# Altium schematic sheet Sheet_1.schdoc
size 322 x 221 mm
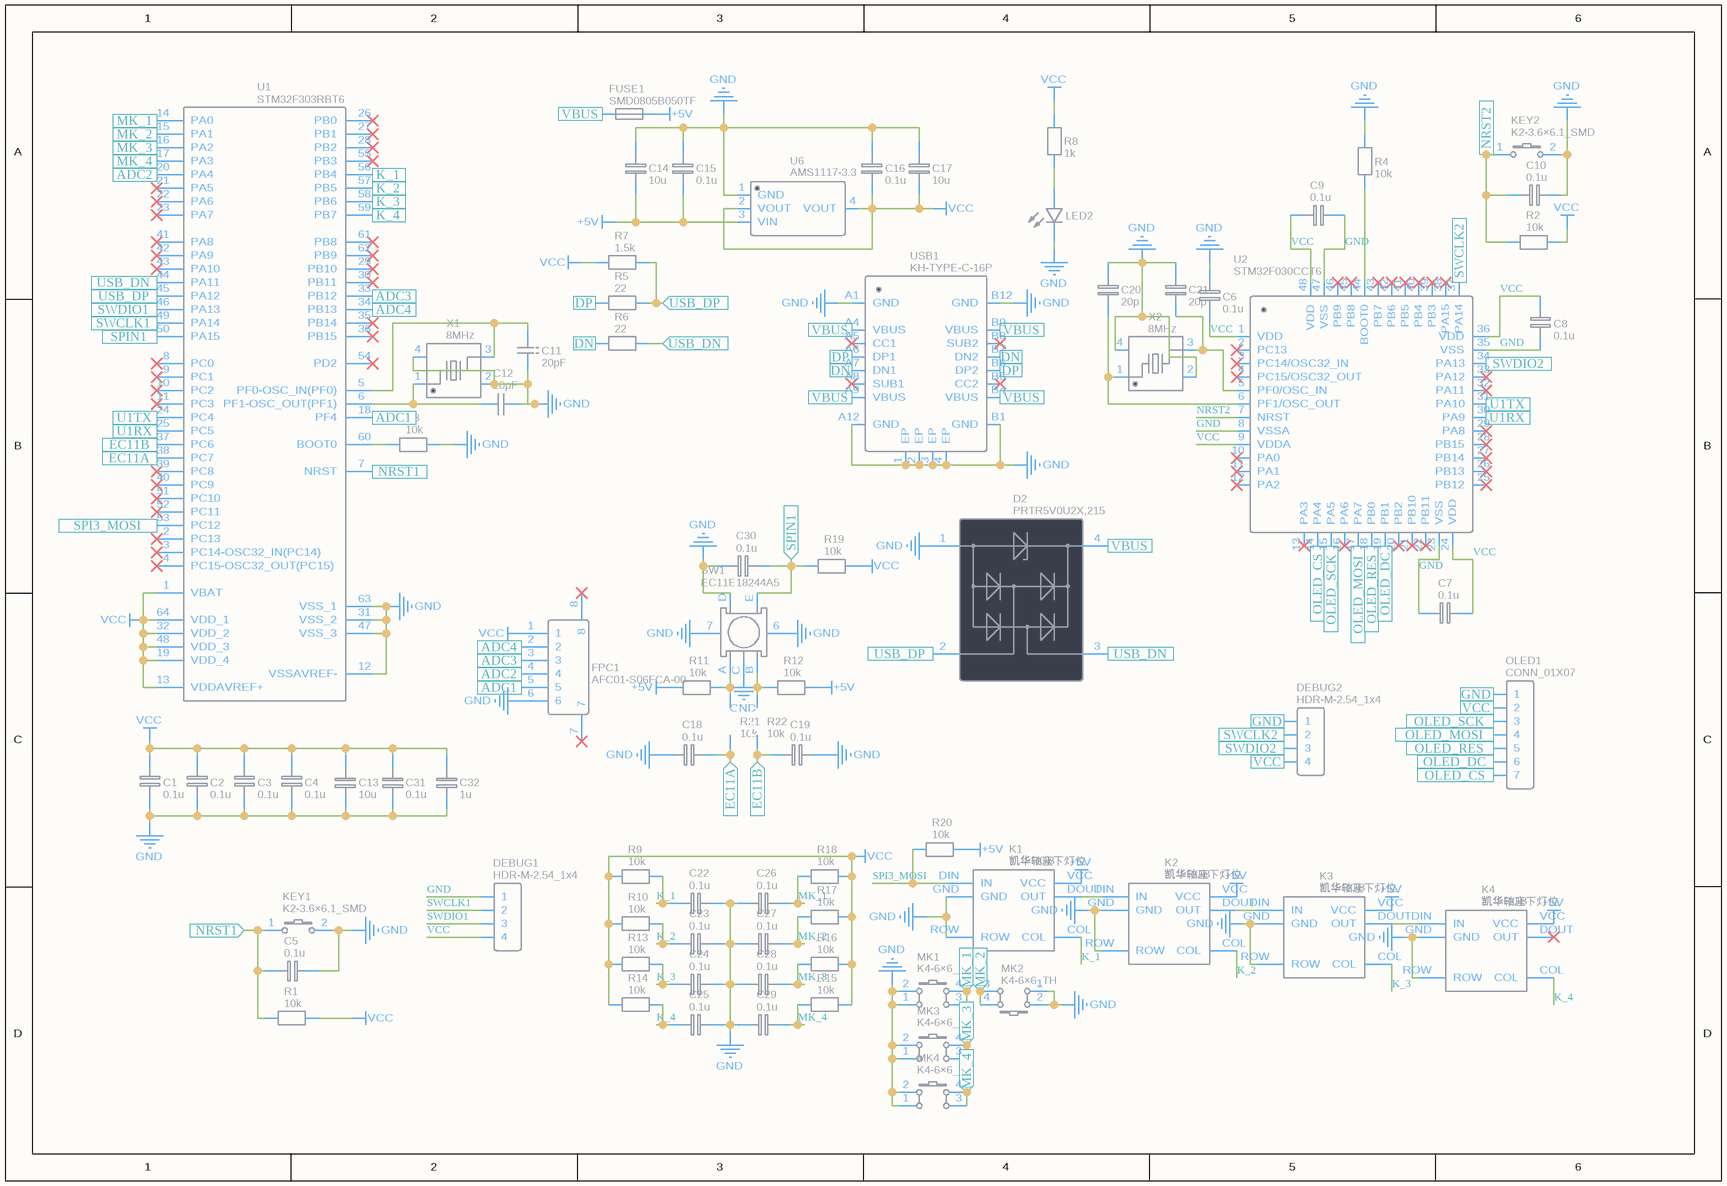
[diagram p0: Sheet_1.schdoc]

## Parts
C1  0.1u  [C0603]
C2  0.1u  [C0603]
C3  0.1u  [C0603]
C4  0.1u  [C0603]
C5  0.1u  [C0603]
C6  0.1u  [C0603]
C7  0.1u  [C0603]
C8  0.1u  [C0603]
C9  0.1u  [C0603]
C10  0.1u  [C0603]
C11  20pF  [C0603]
C12  20pF  [C0603]
C13  10u  [C0603]
C14  10u  [C0603]
C15  0.1u  [C0603]
C16  0.1u  [C0603]
C17  10u  [C0603]
C18  0.1u  [C0603]
C19  0.1u  [C0603]
C20  20p  [C0603]
C21  20p  [C0603]
C22  0.1u  [C0603]
C23  0.1u  [C0603]
C24  0.1u  [C0603]
C25  0.1u  [C0603]
C26  0.1u  [C0603]
C27  0.1u  [C0603]
C28  0.1u  [C0603]
C29  0.1u  [C0603]
C30  0.1u  [C0603]
C31  0.1u  [C0603]
C32  1u  [C0603]
D2  PRTR5V0U2X,215  [SOT-143_L2.9-W1.3-P1.92-LS2.3-BR]
DEBUG1  HDR-M-2.54_1x4  [HDR-M-2.54_1X4]
DEBUG2  HDR-M-2.54_1x4  [HDR-M-2.54_1X4]
FPC1  AFC01-S06FCA-00  [FPC-SMD_P0.50-6P_AFC01-S06FCA-00]
FUSE1  SMD0805B050TF  [F0805]
K1  凯华轴座下灯位  [凯华轴座下灯位]
K2  凯华轴座下灯位  [凯华轴座下灯位]
K3  凯华轴座下灯位  [凯华轴座下灯位]
K4  凯华轴座下灯位  [凯华轴座下灯位]
KEY1  K2-3.6×6.1_SMD  [KEY-SMD_2P-L6.2-W3.6-LS8.0]
KEY2  K2-3.6×6.1_SMD  [KEY-SMD_2P-L6.2-W3.6-LS8.0]
LED2  19-217/BHC-ZL1M2RY/3T  [LED0603-R-RD_BLUE]  (value not drawn)
MK1  K4-6×6_TH  [KEY-TH_4P-L6.0-W6.0-P4.50-LS6.5]
MK2  K4-6×6_TH  [KEY-TH_4P-L6.0-W6.0-P4.50-LS6.5]
MK3  K4-6×6_TH  [KEY-TH_4P-L6.0-W6.0-P4.50-LS6.5]
MK4  K4-6×6_TH  [KEY-TH_4P-L6.0-W6.0-P4.50-LS6.5]
OLED1  CONN_01X07  [HDR-M-2.54_1X7]
R1  10k  [R0603]
R2  10k  [R0603]
R3  10k  [R0603]
R4  10k  [R0603]
R5  22  [R0603]
R6  22  [R0603]
R7  1.5k  [R0603]
R8  1k  [R0603]
R9  10k  [R0603]
R10  10k  [R0603]
R11  10k  [R0603]
R12  10k  [R0603]
R13  10k  [R0603]
R14  10k  [R0603]
R15  10k  [R0603]
R16  10k  [R0603]
R17  10k  [R0603]
R18  10k  [R0603]
R19  10k  [R0603]
R20  10k  [R0603]
R21  10k  [R0603]
R22  10k  [R0603]
SW1  EC11E18244A5  [SW-TH_EC11E18244A5]
U1  STM32F303RBT6  [LQFP-64_L10.0-W10.0-P0.50-LS12.0-BL]
U2  STM32F030CCT6  [LQFP-48_L7.0-W7.0-P0.50-LS9.0-BL]
U6  AMS1117-3.3  [SOT-223-3_L6.5-W3.4-P2.30-LS7.0-BR]
USB1  KH-TYPE-C-16P  [USB-C-SMD_KH-TYPE-C-16P]
X1  8MHz  [OSC-SMD_4P-L3.2-W2.5-BL]
X2  8MHz  [OSC-SMD_4P-L3.2-W2.5-BL]

## Ports
ADC1 (in), ADC2 (in), ADC3 (in), ADC4 (in), DN (in), DP (in), EC11A (in), EC11B (in), GND (in), K_1 (in), K_2 (in), K_3 (in), K_4 (in), MK_1 (in), MK_2 (in), MK_3 (in), MK_4 (in), NRST1 (in), NRST2 (in), OLED_CS (in), OLED_DC (in), OLED_MOSI (in), OLED_RES (in), OLED_SCK (in), SPI3_MOSI (in), SPIN1 (in), SWCLK1 (in), SWCLK2 (in), SWDIO1 (in), SWDIO2 (in), U1RX (in), U1TX (in), USB_DN (in), USB_DP (in), VBUS (in), VCC (in)

## Nets
+5V: C14.1 C15.1 FUSE1.2 K1.VCC K2.VCC K3.VCC K4.VCC R11.1 R12.2 R20.2 U6.3(VIN)
GND: C1.2 C2.2 C3.2 C4.2 C5.1 C6.1 C7.1 C8.2 C9.1 C10.1 C11.2 C12.2 C13.1 C14.2 C15.2 C16.2 C17.2 C18.1 C19.2 C20.2 C21.2 C22.2 C23.2 C24.2 C25.2 C26.1 C27.1 C28.1 C29.1 C30.1 C31.1 C32.1 D2.1(GND) DEBUG1.1 FPC1.6 K1.GND K1.ROW K2.GND K2.ROW K3.GND K3.ROW K4.GND K4.ROW KEY1.2 KEY2.2 LED2.2(C) MK1.1 MK1.2 MK2.1 MK2.2 MK3.1 MK3.2 MK4.1 MK4.2 R3.1 R4.2 SW1.6 SW1.7 SW1.C SW1.D U1.12(VSSAVREF-) U1.31(VSS_2) U1.47(VSS_3) U1.63(VSS_1) U2.8(VSSA) U2.23(VSS) U2.35(VSS) U2.47(VSS) U6.1(GND) USB1.1(EP) USB1.2(EP) USB1.3(EP) USB1.4(EP) USB1.A1(GND) USB1.A12(GND) USB1.B1(GND) USB1.B12(GND) X1.2(GND) X1.4(GND) X2.2(GND) X2.4(GND)
VCC: C1.1 C2.1 C3.1 C4.1 C6.2 C7.2 C8.1 C9.2 C13.2 C16.1 C17.1 C31.2 C32.2 DEBUG1.4 FPC1.1 R1.1 R2.1 R7.1 R8.2 R9.1 R10.1 R13.1 R14.1 R15.2 R16.2 R17.2 R18.2 R19.2 U1.1(VBAT) U1.13(VDDAVREF+) U1.19(VDD_4) U1.32(VDD_2) U1.48(VDD_3) U1.64(VDD_1) U2.1(VDD) U2.9(VDDA) U2.24(VDD) U2.36(VDD) U2.48(VDD) U6.2(VOUT) U6.4(VOUT)
ADC1: FPC1.5 U1.18(PF4) ; port ADC1
ADC2: FPC1.4 U1.20(PA4) ; port ADC2
ADC3: FPC1.3 U1.33(PB12) ; port ADC3
ADC4: FPC1.2 U1.34(PB13) ; port ADC4
DN: R6.1 USB1.A7(DN1) USB1.B7(DN2) ; port DN
DP: R5.1 USB1.A6(DP1) USB1.B6(DP2) ; port DP
EC11A: C18.2 R21.1 U1.38(PC7) ; port EC11A
EC11B: C19.1 R22.1 U1.37(PC6) ; port EC11B
GND: DEBUG2.1 OLED1.1 ; port GND  [a separate net that carries the same name]
K_1: U1.56(PB4) ; port K_1
K_1: C22.1 K1.COL R9.2  [a separate net that carries the same name]
K_2: U1.57(PB5) ; port K_2
K_2: C23.1 K2.COL R10.2  [a separate net that carries the same name]
K_3: U1.58(PB6) ; port K_3
K_3: C24.1 K3.COL R13.2  [a separate net that carries the same name]
K_4: U1.59(PB7) ; port K_4
K_4: C25.1 K4.COL R14.2  [a separate net that carries the same name]
MK_1: MK1.3 MK1.4 MK3.3 MK3.4 MK4.3 MK4.4 U1.14(PA0) U1.16(PA2) U1.17(PA3) ; port MK_1, port MK_3, port MK_4
MK_1: C26.2 R18.1  [a separate net that carries the same name]
MK_2: MK2.3 MK2.4 U1.15(PA1) ; port MK_2
MK_2: C27.2 R17.1  [a separate net that carries the same name]
MK_3: C28.2 R16.1
MK_4: C29.2 R15.1
NRST1: C5.2 KEY1.1 R1.2 U1.7(NRST) ; port NRST1
NRST2: U2.7(NRST)
NRST2: C10.2 KEY2.1 R2.2 ; port NRST2  [a separate net that carries the same name]
OLED_CS: OLED1.7 U2.14(PA4) ; port OLED_CS
OLED_DC: OLED1.6 U2.19(PB1) ; port OLED_DC
OLED_MOSI: OLED1.4 U2.17(PA7) ; port OLED_MOSI
OLED_RES: OLED1.5 U2.18(PB0) ; port OLED_RES
OLED_SCK: OLED1.3 U2.15(PA5) ; port OLED_SCK
SPI3_MOSI: U1.53(PC12) ; port SPI3_MOSI
SPI3_MOSI: K1.DIN(IN) R20.1  [a separate net that carries the same name]
SPIN1: C30.2 R19.1 SW1.E U1.50(PA15) ; port SPIN1
SWCLK1: U1.49(PA14) ; port SWCLK1
SWCLK1: DEBUG1.2  [a separate net that carries the same name]
SWCLK2: DEBUG2.2 U2.37(PA14) ; port SWCLK2
SWDIO1: U1.46(PA13) ; port SWDIO1
SWDIO1: DEBUG1.3  [a separate net that carries the same name]
SWDIO2: DEBUG2.3 U2.34(PA13) ; port SWDIO2
U1RX: U1.25(PC5) U2.30(PA9) ; port U1RX
U1TX: U1.24(PC4) U2.31(PA10) ; port U1TX
USB_DN: D2.3(IO2) R6.2 U1.44(PA11) ; port USB_DN
USB_DP: D2.2(IO1) R5.2 R7.2 U1.45(PA12) ; port USB_DP
VBUS: D2.4(VCC) FUSE1.1 USB1.A4(VBUS) USB1.A9(VBUS) USB1.B4(VBUS) USB1.B9(VBUS) ; port VBUS
VCC: DEBUG2.4 OLED1.2 ; port VCC  [a separate net that carries the same name]
NetC11_1: C11.1 U1.5(PF0-OSC_IN(PF0)) X1.3
NetC12_1: C12.1 U1.6(PF1-OSC_OUT(PF1)) X1.1
NetC20_1: C20.1 U2.6(PF1/OSC_OUT) X2.1
NetC21_1: C21.1 U2.5(PF0/OSC_IN) X2.3
NetK1_DOUT: K1.DOUT(OUT) K2.DIN(IN)
NetK2_DOUT: K2.DOUT(OUT) K3.DIN(IN)
NetK3_DOUT: K3.DOUT(OUT) K4.DIN(IN)
NetLED2_1: LED2.1(A) R8.1
NetR3_2: R3.2 U1.60(BOOT0)
NetR4_1: R4.1 U2.44(BOOT0)
NetR11_2: R11.2 R21.2 SW1.A
NetR12_1: R12.1 R22.2 SW1.B

Not connected (* = marked no-connect by the designer): FPC1 7* 8*; K4 DOUT(OUT)*; U1 2(PC13)* 3(PC14-OSC32_IN(PC14))* 4(PC15-OSC32_OUT(PC15))* 8(PC0)* 9(PC1)* 10(PC2)* 11(PC3)* 21(PA5)* 22(PA6)* 23(PA7)* 26(PB0)* 27(PB1)* 28(PB2)* 29(PB10)* 30(PB11)* 35(PB14)* 36(PB15)* 39(PC8)* 40(PC9)* 41(PA8)* 42(PA9)* 43(PA10)* 51(PC10)* 52(PC11)* 54(PD2)* 55(PB3)* 61(PB8)* 62(PB9)*; U2 2(PC13)* 3(PC14/OSC32_IN)* 4(PC15/OSC32_OUT)* 10(PA0)* 11(PA1)* 12(PA2)* 13(PA3)* 16(PA6)* 20(PB2)* 21(PB10)* 22(PB11)* 25(PB12)* 26(PB13)* 27(PB14)* 28(PB15)* 29(PA8)* 32(PA11)* 33(PA12)* 38(PA15)* 39(PB3)* 40(PB4)* 41(PB5)* 42(PB6)* 43(PB7)* 45(PB8)* 46(PB9)*; USB1 A5(CC1)* A8(SUB1)* B5(CC2)* B8(SUB2)*

## Notes on the sheet
- (in symbol 凯华轴座下灯位) 凯华RGB

## Library data of the parts
C1-C10 C15 C16 C18 C19 C22-C31 = 0.1u: BOM_Manufacturer Part: CC0603KRX7R9BB104; BOM_Manufacturer: YAGEO(国巨); nameAlias: Value(F); Contributor: LCEDA_Lib; BOM_Supplier Part: C14663; BOM_Supplier: LCSC; spicePre: C; spiceSymbolName: C_0603_EU
C11 C12 = 20pF: BOM_Manufacturer Part: CL10C200JB8NNNC; BOM_Manufacturer: SAMSUNG(三星); nameAlias: Capacitance; BOM_Supplier: LCSC; BOM_Supplier Part: C1648; BOM_JLCPCB Part Class: Basic Part; spicePre: C; spiceSymbolName: CL10C200JB8NNNC
C13 C14 C17 = 10u: BOM_Manufacturer Part: CL10A106KP8NNNC; BOM_Manufacturer: SAMSUNG(三星); nameAlias: Value(F); Contributor: LCEDA_Lib; BOM_Supplier Part: C19702; BOM_Supplier: LCSC; spicePre: C; spiceSymbolName: C_0603_EU
C20 C21 = 20p: BOM_Manufacturer Part: CL10C200JB8NNNC; BOM_Manufacturer: SAMSUNG(三星); nameAlias: Value(F); Contributor: LCEDA_Lib; BOM_Supplier Part: C1648; BOM_Supplier: LCSC; spicePre: C; spiceSymbolName: C_0603_EU
C32 = 1u: BOM_Manufacturer Part: CL10A105KO8NNNC; BOM_Manufacturer: SAMSUNG(三星); nameAlias: Value(F); Contributor: LCEDA_Lib; BOM_Supplier Part: C1592; BOM_Supplier: LCSC; spicePre: C; spiceSymbolName: C_0603_EU
D2 = PRTR5V0U2X,215: BOM_Manufacturer: Nexperia(安世); BOM_Supplier: LCSC; BOM_Manufacturer Part: PRTR5V0U2X,215; BOM_Supplier Part: C12333; BOM_JLCPCB Part Class: Extended Part; spicePre: D; spiceSymbolName: PRTR5V0U2X,215
DEBUG1 DEBUG2 = HDR-M-2.54_1x4: Contributor: LCEDA_Lib; BOM_Supplier Part: C124378; BOM_Supplier: LCSC; spicePre: J; spiceSymbolName: HDR-M-2.54_1x4
FPC1 = AFC01-S06FCA-00: BOM_Manufacturer: JS(钜硕电子); Contributor: LCSC; BOM_Supplier: LCSC; BOM_Supplier Part: C262655; BOM_Manufacturer Part: AFC01-S06FCA-00; BOM_JLCPCB Part Class: Extended Part; spicePre: F; spiceSymbolName: AFC01-S06FCA-00
FUSE1 = SMD0805B050TF: BOM_Manufacturer: Brightking(君耀电子); Contributor: LCSC; Package Display: No; BOM_Supplier: LCSC; BOM_Supplier Part: C269104; BOM_Manufacturer Part: SMD0805B050TF; BOM_JLCPCB Part Class: Extended Part; spicePre: U; spiceSymbolName: SMD0805B050TF
K1-K4 = 凯华轴座下灯位: Contributor: asdaasadf; spicePre: U; spiceSymbolName: 凯华轴座下灯位
KEY1 KEY2 = K2-3.6×6.1_SMD: BOM_Manufacturer Part: K2-1107ST-A4SW-06; Contributor: LCEDA_Lib; 制造商: 韩国韩荣; BOM_Supplier Part: C118141; BOM_Supplier: LCSC; spicePre: K; spiceSymbolName: K2-3.6×6.1_SMD
LED2 = 19-217/BHC-ZL1M2RY/3T: BOM_Manufacturer: EVERLIGHT(亿光); BOM_Supplier: LCSC; BOM_Manufacturer Part: 19-217/BHC-ZL1M2RY/3T; BOM_Supplier Part: C72041; BOM_JLCPCB Part Class: Basic Part; spicePre: L; spiceSymbolName: 19-217/BHC-ZL1M2RY/3T
MK1-MK4 = K4-6×6_TH: BOM_Manufacturer: 韩国韩荣; BOM_Manufacturer Part: K2-1102DP-E4SW-04; Contributor: LCEDA_Lib; BOM_Supplier: LCSC; BOM_Supplier Part: C136684; spicePre: K; spiceSymbolName: K4-6×6_TH
OLED1 = CONN_01X07: Contributor: KiCAD; spicePre: J; spiceSymbolName: CONN_01X07
R1-R4 R9-R20 = 10k: BOM_Manufacturer Part: 0603WAF1002T5E; BOM_Manufacturer: UNI-ROYAL(厚声); nameAlias: Value(Ω); Contributor: LCEDA_Lib; BOM_Supplier Part: C25804; BOM_Supplier: LCSC; spicePre: R; spiceSymbolName: R_0603_EU
R5 R6 = 22: BOM_Manufacturer Part: 0603WAF220JT5E; BOM_Manufacturer: UNI-ROYAL(厚声); nameAlias: Value(Ω); Contributor: LCEDA_Lib; BOM_Supplier Part: C23345; BOM_Supplier: LCSC; spicePre: R; spiceSymbolName: R_0603_EU
R7 = 1.5k: BOM_Manufacturer Part: 0603WAF1501T5E; BOM_Manufacturer: UNI-ROYAL(厚声); nameAlias: Value(Ω); Contributor: LCEDA_Lib; BOM_Supplier Part: C22843; BOM_Supplier: LCSC; spicePre: R; spiceSymbolName: R_0603_EU
R8 = 1k: BOM_Manufacturer Part: 0603WAF1001T5E; BOM_Manufacturer: UNI-ROYAL(厚声); nameAlias: Value(Ω); Contributor: LCEDA_Lib; BOM_Supplier Part: C21190; BOM_Supplier: LCSC; spicePre: R; spiceSymbolName: R_0603_EU
R21 R22 = 10k: nameAlias: Value(Ω); Contributor: LCEDA_Lib; spicePre: R; spiceSymbolName: R_0603_EU
SW1 = EC11E18244A5: BOM_Manufacturer: ALPS Electric; Contributor: LCSC; BOM_Supplier: LCSC; BOM_Supplier Part: C255515; BOM_Manufacturer Part: EC11E18244A5; BOM_JLCPCB Part Class: Extended Part; spicePre: S; spiceSymbolName: EC11E18244A5
U1 = STM32F303RBT6: BOM_Manufacturer: ST(意法半导体); Voltage - Supply: 2V ~ 3.6V; Contributor: LCSC; BOM_Supplier: LCSC; BOM_Manufacturer Part: STM32F303RBT6; BOM_Supplier Part: C130453; BOM_JLCPCB Part Class: Extended Part; spicePre: U; spiceSymbolName: STM32F303RBT6
U2 = STM32F030CCT6: BOM_Manufacturer: ST(意法半导体); BOM_Supplier: LCSC; BOM_Manufacturer Part: STM32F030CCT6; BOM_Supplier Part: C81787; BOM_JLCPCB Part Class: Extended Part; spicePre: U; spiceSymbolName: STM32F030CCT6
U6 = AMS1117-3.3: BOM_Manufacturer: AMS; sourceId: dwIGgezVh; timeStamp: 1476261164; BOM_Supplier: LCSC; BOM_Manufacturer Part: AMS1117-3.3; BOM_Supplier Part: C6186; BOM_JLCPCB Part Class: Basic Part; spicePre: U; spiceSymbolName: AMS1117-3.3
USB1 = KH-TYPE-C-16P: BOM_Manufacturer: kinghelm(金航标); Contributor: LCSC; BOM_Supplier: LCSC; BOM_Supplier Part: C709357; BOM_Manufacturer Part: KH-TYPE-C-16P; BOM_JLCPCB Part Class: Extended Part; spicePre: U; spiceSymbolName: KH-TYPE-C-16P
X1 X2 = 8MHz: BOM_Manufacturer: YXC(扬兴晶振); BOM_Manufacturer Part: X32258MOB4SI; Contributor: LCSC; nameAlias: Frequency; BOM_Supplier: LCSC; BOM_Supplier Part: C2682775; BOM_JLCPCB Part Class: Extended Part; spicePre: X; spiceSymbolName: X32258MOB4SI